# EAGLE design zdroj12v3v7 (EAGLE 7.2.0)
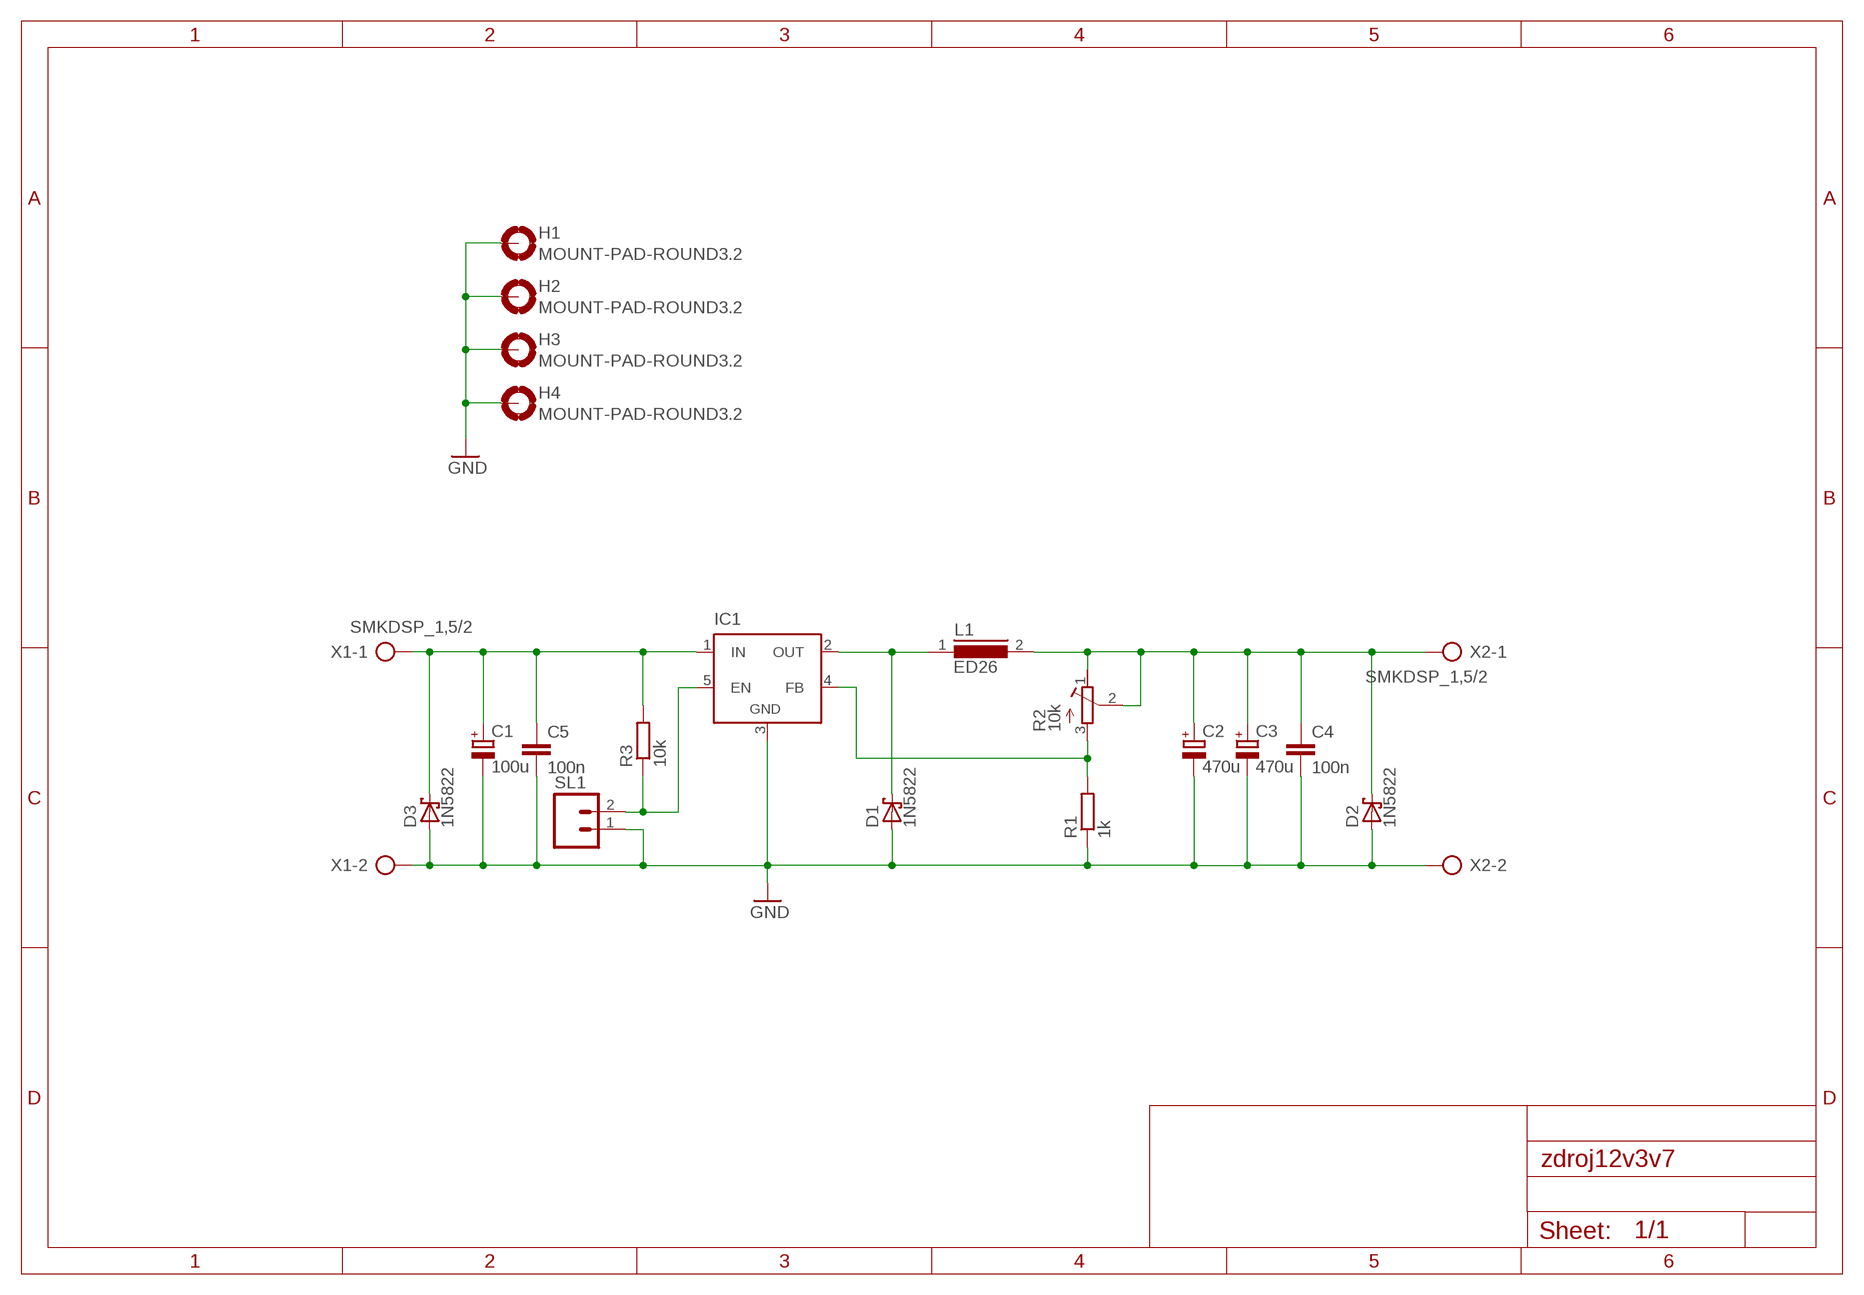
[diagram p0: schematic, sheet 1]

## Parts
C1  100u  CPOL-EUE5-8.5  [E5-8,5]
C2  470u  CPOL-EUE5-10.5  [E5-10,5]
C3  470u  CPOL-EUE5-10.5  [E5-10,5]
C4  100n  C-EU050-035X075  [C050-035X075]
C5  100n  C-EU050-035X075  [C050-035X075]
D1  1N5822  SCHOTTKY-DIODEDO201T15  [DO201T15]
D2  1N5822  SCHOTTKY-DIODEDO201T15  [DO201T15]
D3  1N5822  SCHOTTKY-DIODEDO201T15  [DO201T15]
H1  MOUNT-PAD-ROUND3.2  [3,2-PAD]
H2  MOUNT-PAD-ROUND3.2  [3,2-PAD]
H3  MOUNT-PAD-ROUND3.2  [3,2-PAD]
H4  MOUNT-PAD-ROUND3.2  [3,2-PAD]
IC1  LM2596TH  [TO220-52]
L1  ED26  [ED26]
R1  1k  R-EU_0207/10  [0207/10]
R2  10k  R-TRIMM3006P  [RTRIM3006P]
R3  10k  R-EU_0207/10  [0207/10]
SL1  M02  [02P]
X1  SMKDSP_1,5/2  [SMKDSP_1,5/2]
X2  SMKDSP_1,5/2  [SMKDSP_1,5/2]

## Nets
GND: C1.- C2.- C3.- C4.2 C5.2 D1.A D2.A D3.A H1.B3,2(MOUNT) H2.B3,2(MOUNT) H3.B3,2(MOUNT) H4.B3,2(MOUNT) IC1.3(GND) R1.1 SL1.1 X1.2 X2.2
N$1: D1.C IC1.2(OUT) L1.1
N$2: C2.+ C3.+ C4.1 D2.C L1.2 R2.1(E) R2.2(S) X2.1
N$3: IC1.4(FB) R1.2 R2.3(A)
N$4: IC1.5(EN) R3.1 SL1.2
N$6: C1.+ C5.1 D3.C IC1.1(IN) R3.2 X1.1

## Library data of the parts
C1-C3 = rcl:CPOL-EU: POLARIZED CAPACITOR, European symbol
C4 C5 = rcl:C-EU: CAPACITOR, European symbol
D1-D3 = diode:SCHOTTKY-DIODE: Schottky Diode
H1-H4 = holes:MOUNT-PAD-ROUND: MOUNTING PAD, round
IC1 = linear:LM2596T: STEP-DOWN VOLTAGE REGULATOR
L1 = inductors:ED26: INDUCTOR
R1 R3 = rcl:R-EU_: RESISTOR, European symbol
R2 = rcl:R-TRIMM: Trimm resistor
SL1 = con-amp-quick:M02: AMP QUICK CONNECTOR; OC_FARNELL: unknown; OC_NEWARK: unknown
X1 X2 = con-phoenix-smkdsp:SMKDSP_1,5/2: Printklemme, Nennstrom: 17,5 A, Bemessungsspannung: 250 V, Raster: 5,0 mm Source: http://eshop.phoenixcontact.de .. 1733415.pdf; MF: FARNELL; MPN: 1733570; OC_FARNELL: 3041244; OC_NEWARK: 69C8588

## Board
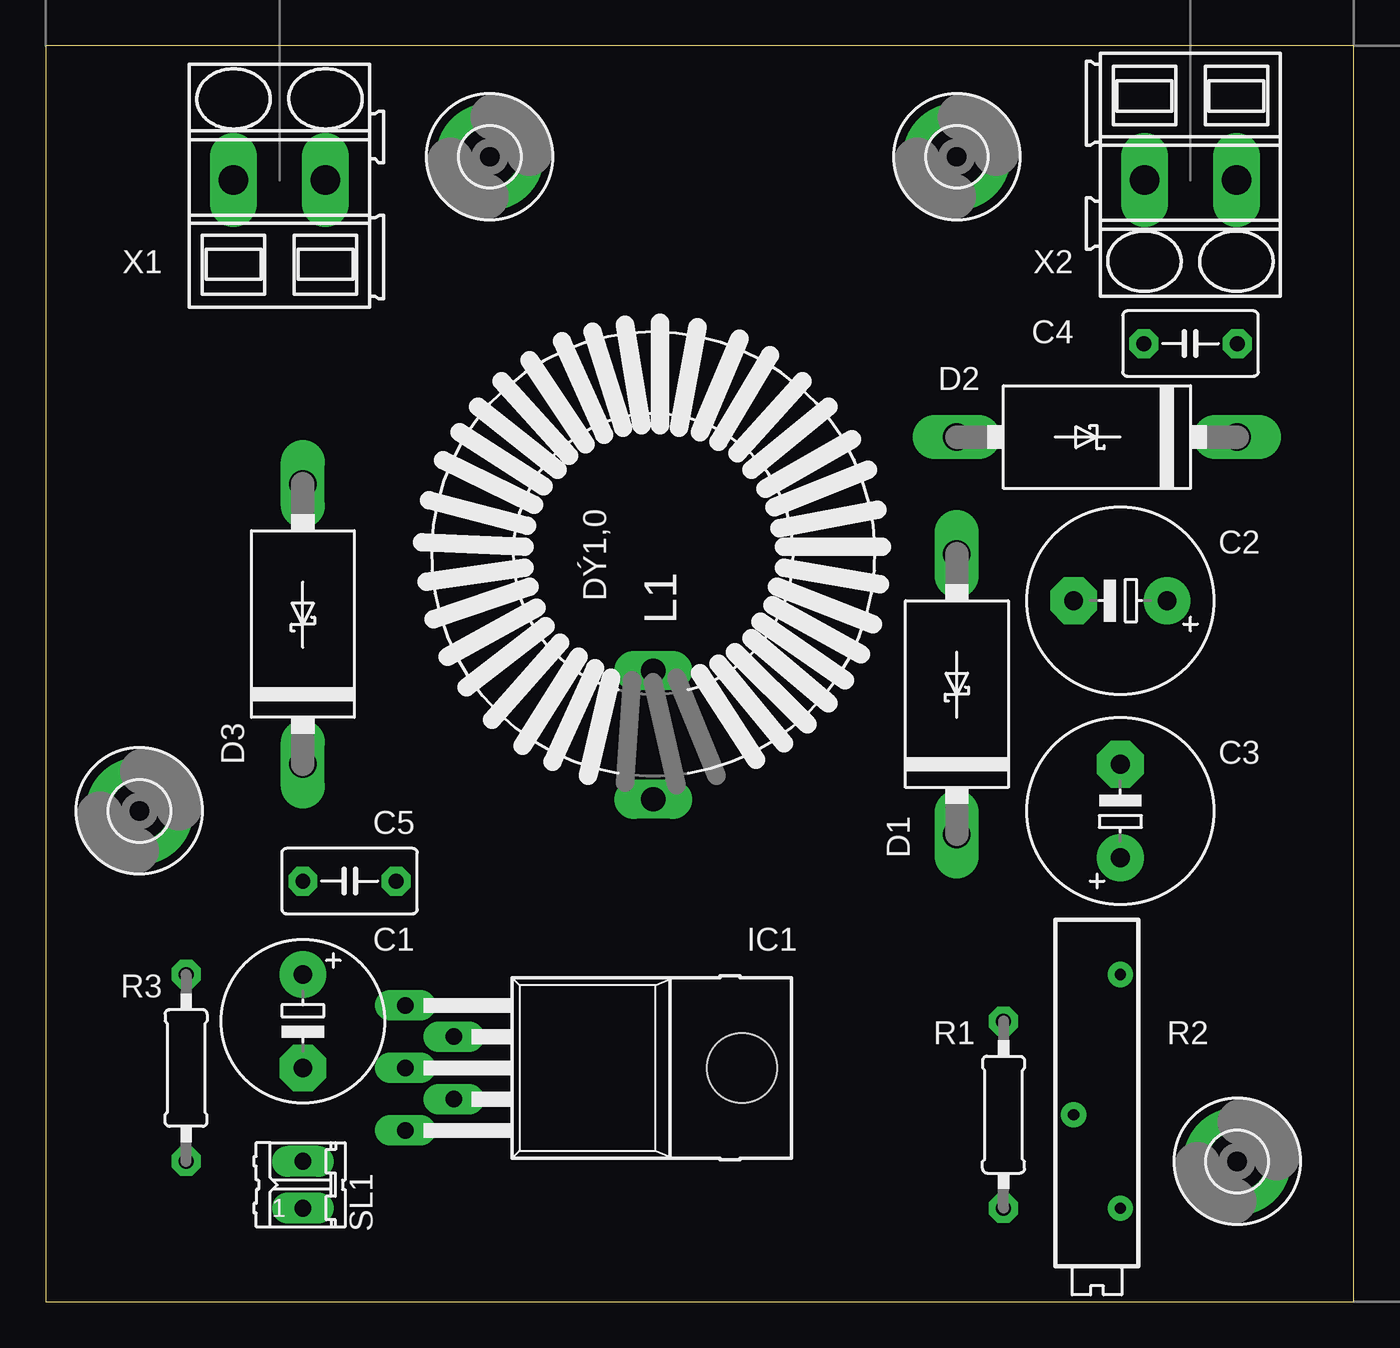
[diagram p1: board, top side]
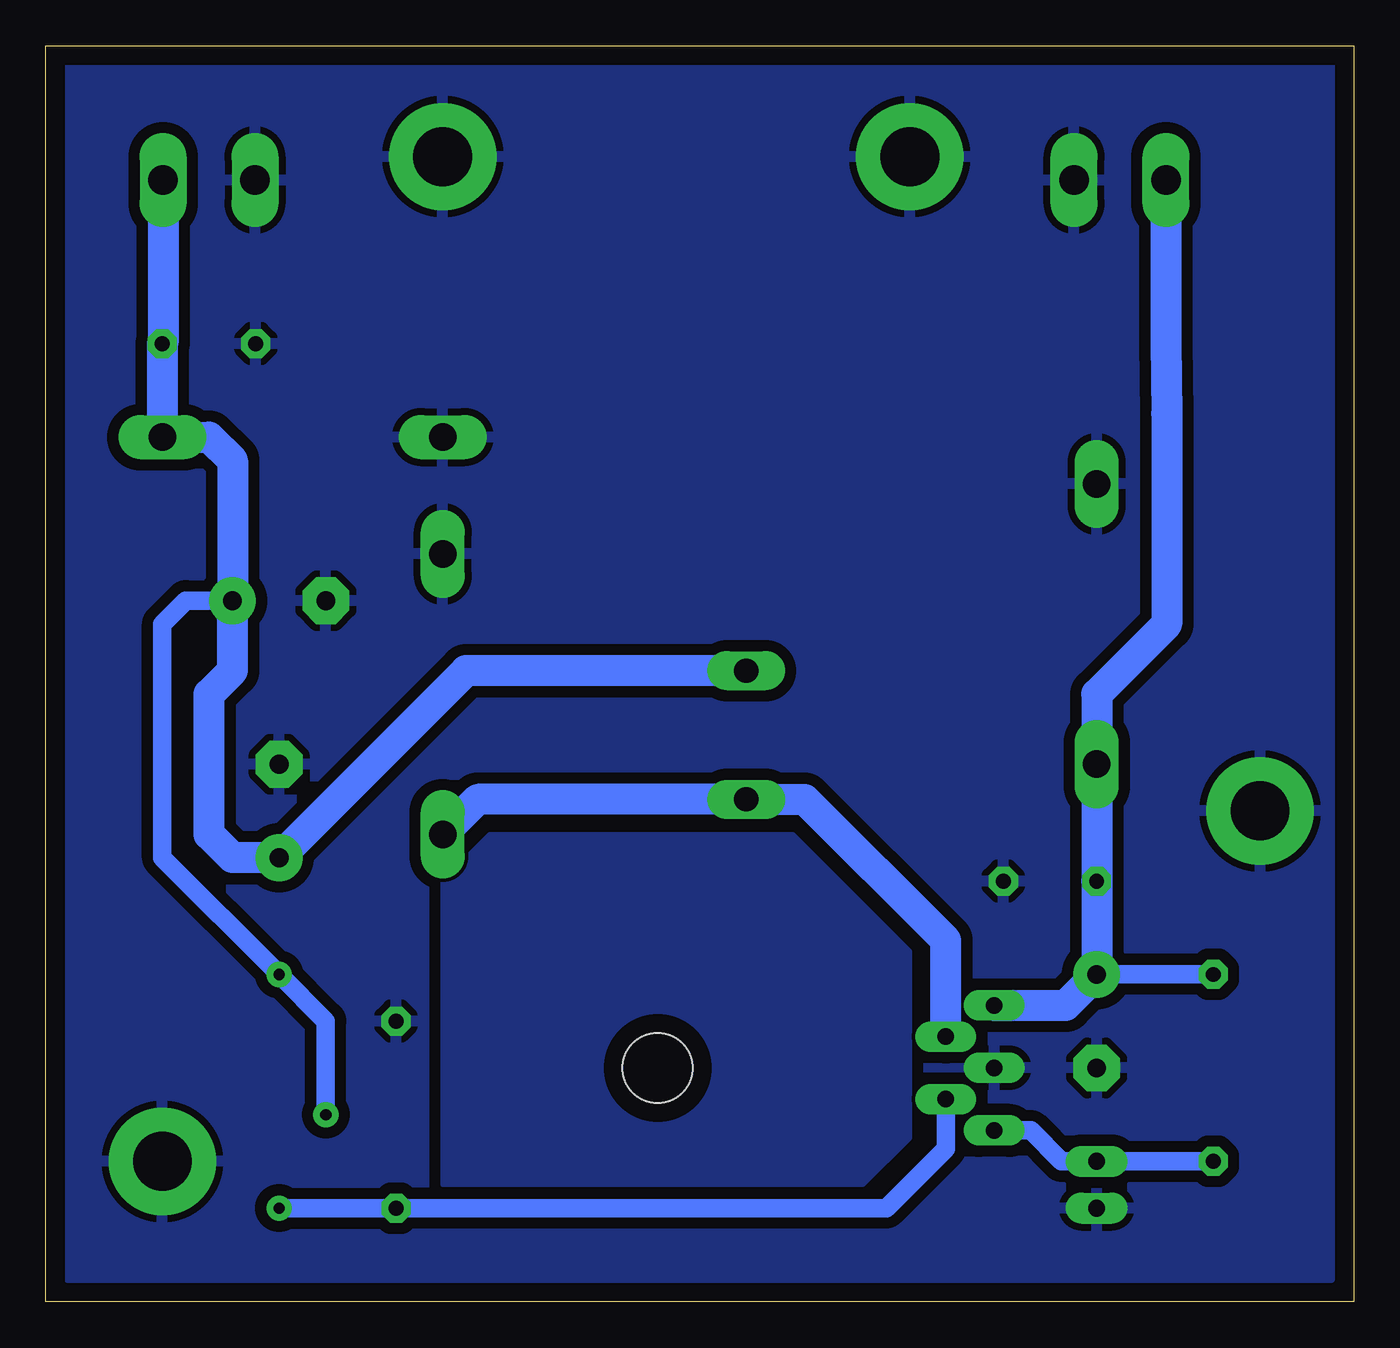
[diagram p2: board, bottom side, seen from below]

Size 71.1 x 68.25 mm. Coordinates in mm from the lower left corner, seen from the top.
Outline: 0,0 71.1,0 71.1,68.25 0,68.25 0,0
Copper layers (1*16): Top 0.035mm / dielectric 1.5mm / Bottom 0.035mm
Design rules "default *": minimum track width 10mil, minimum drill 24mil, track to track 8mil, track to pad 8mil, pad to pad 8mil, via to via 8mil, smd to smd 8mil, copper to edge 40mil, drill to drill 8mil, minimum pad ring 15mil, minimum via ring 8mil, stop-mask expansion 4mil, vias tented up to drill 0mil, thermal gap 15mil

### Footprints (pad centres in the part's own frame; a part is rotated, then mirrored left to right if it is on the bottom)
E5-8,5 = drill 1.016 pad 2.54: + -2.54,0 | drill 1.016 pad 2.54 octagon: - 2.54,0
E5-10,5 = drill 1.016 pad 2.54: + -2.54,0 | drill 1.016 pad 2.54 octagon: - 2.54,0
C050-035X075 = drill 0.813 octagon: 1 -2.54,0; 2 2.54,0
DO201T15 = drill 1.499 long: A 7.62,0; C -7.62,0
3,2-PAD = drill 3.2 pad 5.842: B3,2 0,0
TO220-52 = drill 0.9 long: 1 -3.4,-21.1; 2 -1.7,-18.47; 3 0,-21.1; 4 1.7,-18.47; 5 3.4,-21.1 | hole 3.8: 0,-2.8
ED26 = drill 1.321 long: 1 -13.335,0; 2 -6.35,0
0207/10 = drill 0.813 octagon: 1 -5.08,0; 2 5.08,0
RTRIM3006P = drill 0.61: 1 -7.62,1.27; 2 0,-1.27; 3 5.08,1.27
02P = drill 0.914 long: 1 -1.27,0; 2 1.27,0
SMKDSP_1,5/2 = drill 1.6 pad 1.8 long: 1 -2.5,0; 2 2.5,0

### Placement (x,y rotation side)
C1  13.97,15.24 270 top
C2  58.42,38.1 180 top
C3  58.42,26.67 90 top
C4  62.23,52.07 180 top
C5  16.51,22.86 0 top
D1  49.53,33.02 90 top
D2  57.15,46.99 180 top
D3  13.97,36.83 90 top
H1  24.13,62.23 0 top
H2  49.53,62.23 0 top
H3  64.77,7.62 0 top
H4  5.08,26.67 0 top
IC1  40.64,12.7 270 top
L1  33.02,40.64 90 top
R1  52.07,10.16 270 top
R2  57.15,10.16 270 top
R3  7.62,12.7 90 top
SL1  13.97,6.35 90 top
X1  12.7,60.96 0 top
X2  62.23,60.96 180 top

### Tracks (layer width: path | path; a pad name or v marks a point on that pad's centre or on a via)
GND
  pour Bottom (isolate 0.61, rank 2): 1.27,67.31 69.85,67.31 69.85,1.27 1.27,1.27
N$1
  Bottom 1.676: IC1.2 22.17,19.63 29.84,27.3 L1.1 47.62,27.3 D1.C
N$2
  Bottom 1.016: C2.+ 63.5,38.1 64.77,36.83 64.77,24.13 R2.1 55.88,15.24 R2.2
  Bottom 1.676: X2.1 64.73,52.11 C4.1 D2.C 62.23,46.99 60.96,45.72 C2.+ 60.96,34.29 62.23,33.02 62.23,25.4 60.96,24.13 C3.+ 48.26,34.29 L1.2
N$3
  Bottom 1.016: R2.3 R1.2 25.4,5.08 22.17,8.31 IC1.4
N$4
  Bottom 1.016: IC1.5 17.55,9.3 15.88,7.62 SL1.2 R3.1
N$5
  pour Bottom: 24.13,8.89 24.13,19.05 30.48,25.4 46.99,25.4 49.53,22.86 49.53,6.35 26.67,6.35
N$6
  Bottom 1.016: R3.2 C1.+
  Bottom 1.676: X1.1 10.2,52.11 10.16,48.26 10.16,36.83 13.97,33.02 D3.C C5.1 C1.+ 15.65,16.1 IC1.1